# Altium schematic sheet Digital_Buffer.SchDoc
size A4; SheetNumber: 5; SheetTotal: 6
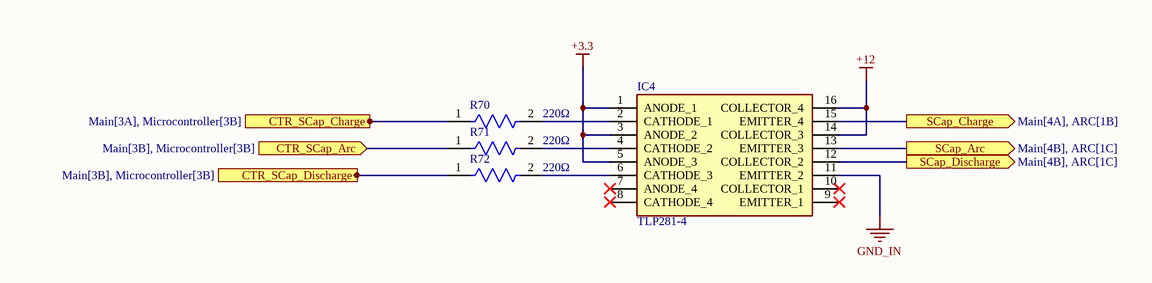
[diagram p0: Digital_Buffer.SchDoc]

## Parts
IC4  TLP281-4  [SOIC127P700X210-16N]
R70  value 220Ω  [FP-RT1206-MFG]  (hidden comment: RT1206FRE07220RL)
R71  value 220Ω  [FP-RT1206-MFG]  (hidden comment: RT1206FRE07220RL)
R72  value 220Ω  [FP-RT1206-MFG]  (hidden comment: RT1206FRE07220RL)

## Ports
CTR_SCap_Arc (in, see Main[3B], Microcontroller[3B]), CTR_SCap_Charge (in, see Main[3A], Microcontroller[3B]), CTR_SCap_Discharge (in, see Main[3B], Microcontroller[3B]), SCap_Arc (out, see Main[4B], ARC[1C]), SCap_Charge (out, see Main[4A], ARC[1B]), SCap_Discharge (out, see Main[4B], ARC[1C])

## Nets
+3.3: IC4.1(ANODE_1) IC4.3(ANODE_2) IC4.5(ANODE_3)
+12: IC4.14(COLLECTOR_3) IC4.16(COLLECTOR_4)
GND_IN: IC4.11(EMITTER_2)
CTR_SCap_Arc: R71.1 ; port CTR_SCap_Arc
CTR_SCap_Charge: R70.1 ; port CTR_SCap_Charge
CTR_SCap_Discharge: R72.1 ; port CTR_SCap_Discharge
SCap_Arc: IC4.13(EMITTER_3) ; port SCap_Arc
SCap_Charge: IC4.15(EMITTER_4) ; port SCap_Charge
SCap_Discharge: IC4.12(COLLECTOR_2) ; port SCap_Discharge
NetIC4_2: IC4.2(CATHODE_1) R70.2
NetIC4_4: IC4.4(CATHODE_2) R71.2
NetIC4_6: IC4.6(CATHODE_3) R72.2

Not connected (* = marked no-connect by the designer): IC4 7(ANODE_4)* 8(CATHODE_4)* 9(EMITTER_1)* 10(COLLECTOR_1)*

## Library data of the parts
IC4 = TLP281-4: Integrated Circuit; Manufacturer_Name: Toshiba; Datasheet Link: https://www.datasheet5.com/part/TLP281-4/Toshiba%20America%20Electronic%20Components/ecad-model; Height: 2.1mm; Manufacturer_Part_Number: TLP281-4; Mouser Part Number: 757-TLP281-4; Mouser Price/Stock: https://www.mouser.co.uk/ProductDetail/Toshiba/TLP281-4?qs=nul2o59pkPL9bOIg9yeNdw%3D%3D
R70-R72 = CMP-03412-012208-1: RES SMD 220 OHM 1% 1/4W 1206; Manufacturer: Yageo; Power Rating: 0.25W; Tolerance: 0.0002; Temperature Coefficient: 50 ppm/°C; Voltage Rating: 200V; RoHS: TRUE; Device Class L2: Resistors; Composition: Thin Film; Mouser Description: Res Thin Film 1206 220 Ohm 1% 0.25W(1/4W) ±50ppm/C Epoxy Pad SMD T/R; Manufacturer Part Number: RT1206FRE07220RL; Package: RT1206; Automotive: No; Category: Res; Temperature Range High: +155°C; Temperature Range Low: -55°C; Footprint Url: http://www.yageo.com/exep/pages/download/literatures/PYu-R_Mount_10.pdf; Series: RT; Height: 0.65mm; Digikey Description: RES SMD 220 OHM 1% 1/4W 1206; Temperature: -55°C to +155°C; Lead Free: Yes; ComponentLink2Description: Datasheet; Device Class L1: Passive Components; Device Class L3: Chip SMD Resistors; ComponentLink2URL: http://www.yageo.com/documents/recent/PYu-RT_1-to-0.01_RoHS_L_9.pdf; Ipc Land Pattern Name: RESC310160X55; Resistance: 220Ω; Octopart: https://octopart.com/rt1206fre07220rl-yageo-1236006